# Altium schematic sheet sign_filter.schdoc
size 204 x 150 mm
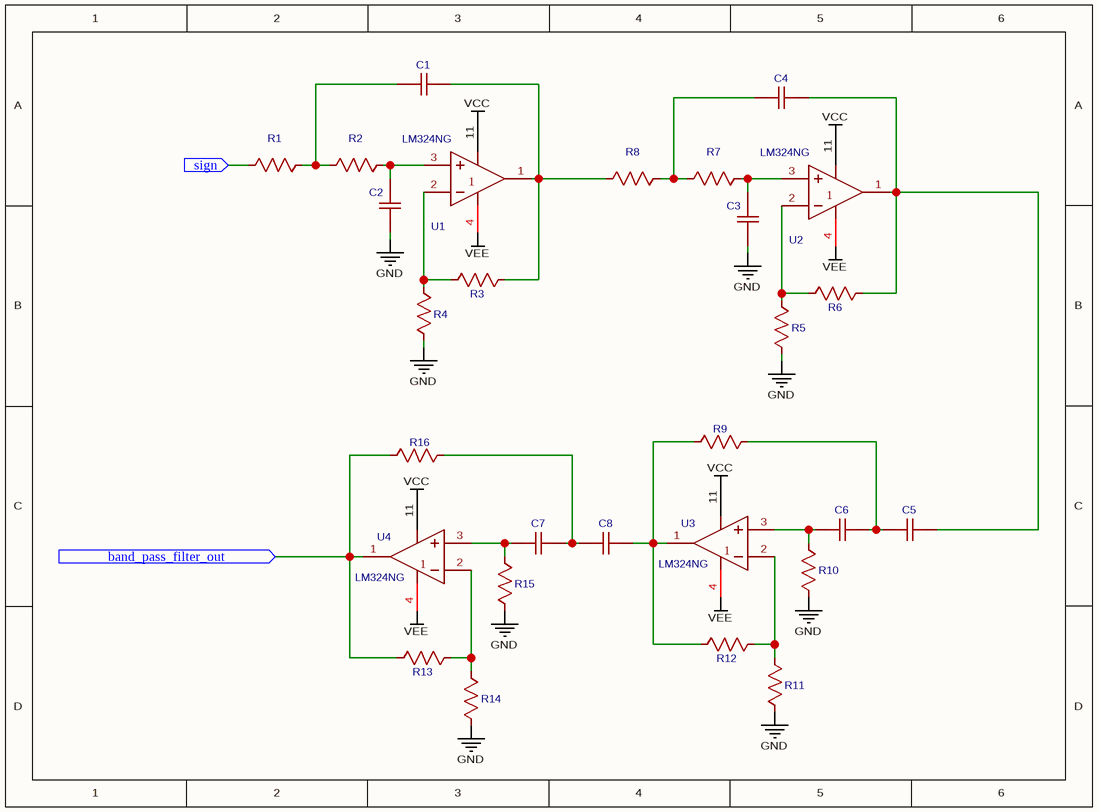
[diagram p0: sign_filter.schdoc]

## Parts
C1  0.1u  [C0402]  (value not drawn)
C2  0.1u  [C0402]  (value not drawn)
C3  0.1u  [C0402]  (value not drawn)
C4  0.1u  [C0402]  (value not drawn)
C5  0.1u  [C0402]  (value not drawn)
C6  0.1u  [C0402]  (value not drawn)
C7  0.1u  [C0402]  (value not drawn)
C8  0.1u  [C0402]  (value not drawn)
R1  1k  [R0402]  (value not drawn)
R2  1k  [R0402]  (value not drawn)
R3  1k  [R0402]  (value not drawn)
R4  1k  [R0402]  (value not drawn)
R5  1k  [R0402]  (value not drawn)
R6  1k  [R0402]  (value not drawn)
R7  1k  [R0402]  (value not drawn)
R8  1k  [R0402]  (value not drawn)
R9  1k  [R0402]  (value not drawn)
R10  1k  [R0402]  (value not drawn)
R11  1k  [R0402]  (value not drawn)
R12  1k  [R0402]  (value not drawn)
R13  1k  [R0402]  (value not drawn)
R14  1k  [R0402]  (value not drawn)
R15  1k  [R0402]  (value not drawn)
R16  1k  [R0402]  (value not drawn)
U1  LM324NG  [PDIP-14_L19.7-W6.6-P2.54-LS8.3-BL]
U2  LM324NG  [PDIP-14_L19.7-W6.6-P2.54-LS8.3-BL]
U3  LM324NG  [PDIP-14_L19.7-W6.6-P2.54-LS8.3-BL]
U4  LM324NG  [PDIP-14_L19.7-W6.6-P2.54-LS8.3-BL]

## Ports
band_pass_filter_out (in), sign (in)

## Nets
GND: C2.1 C3.1 R4.2 R5.2 R10.1 R11.1 R14.1 R15.1
VCC: U1.11(GND) U2.11(GND) U3.11(GND) U4.11(GND)
VEE: U1.4(VCC) U2.4(VCC) U3.4(VCC) U4.4(VCC)
band_pass_filter_out: R13.1 R16.2 U4.1(OUT1) ; port band_pass_filter_out
sign: R1.1 ; port sign
NetC1_1: C1.1 R1.2 R2.1
NetC1_2: C1.2 R3.2 R8.1 U1.1(OUT1)
NetC2_2: C2.2 R2.2 U1.3(IN1+)
NetC3_2: C3.2 R7.2 U2.3(IN1+)
NetC4_1: C4.1 R7.1 R8.2
NetC4_2: C4.2 C5.2 R6.2 U2.1(OUT1)
NetC5_1: C5.1 C6.2 R9.1
NetC6_1: C6.1 R10.2 U3.3(IN1+)
NetC7_1: C7.1 R15.2 U4.3(IN1+)
NetC7_2: C7.2 C8.1 R16.1
NetC8_2: C8.2 R9.2 R12.1 U3.1(OUT1)
NetR3_1: R3.1 R4.1 U1.2(IN1-)
NetR5_1: R5.1 R6.1 U2.2(IN1-)
NetR11_2: R11.2 R12.2 U3.2(IN1-)
NetR13_2: R13.2 R14.2 U4.2(IN1-)

## Library data of the parts
C1-C8 = 0.1u: nameAlias: Value(F); Contributor: LCEDA_Lib; spicePre: C; spiceSymbolName: C_0402_US
R1-R16 = 1k: nameAlias: Value(Ω); Contributor: LCEDA_Lib; spicePre: R; spiceSymbolName: R_0402_US
U1-U4 = LM324NG: BOM_Manufacturer Part: ON; subpart_no: 1; BOM_Supplier Part: C99121; BOM_Supplier: LCSC; BOM_Manufacturer: LM324NG; spicePre: U; spiceSymbolName: LM324NG